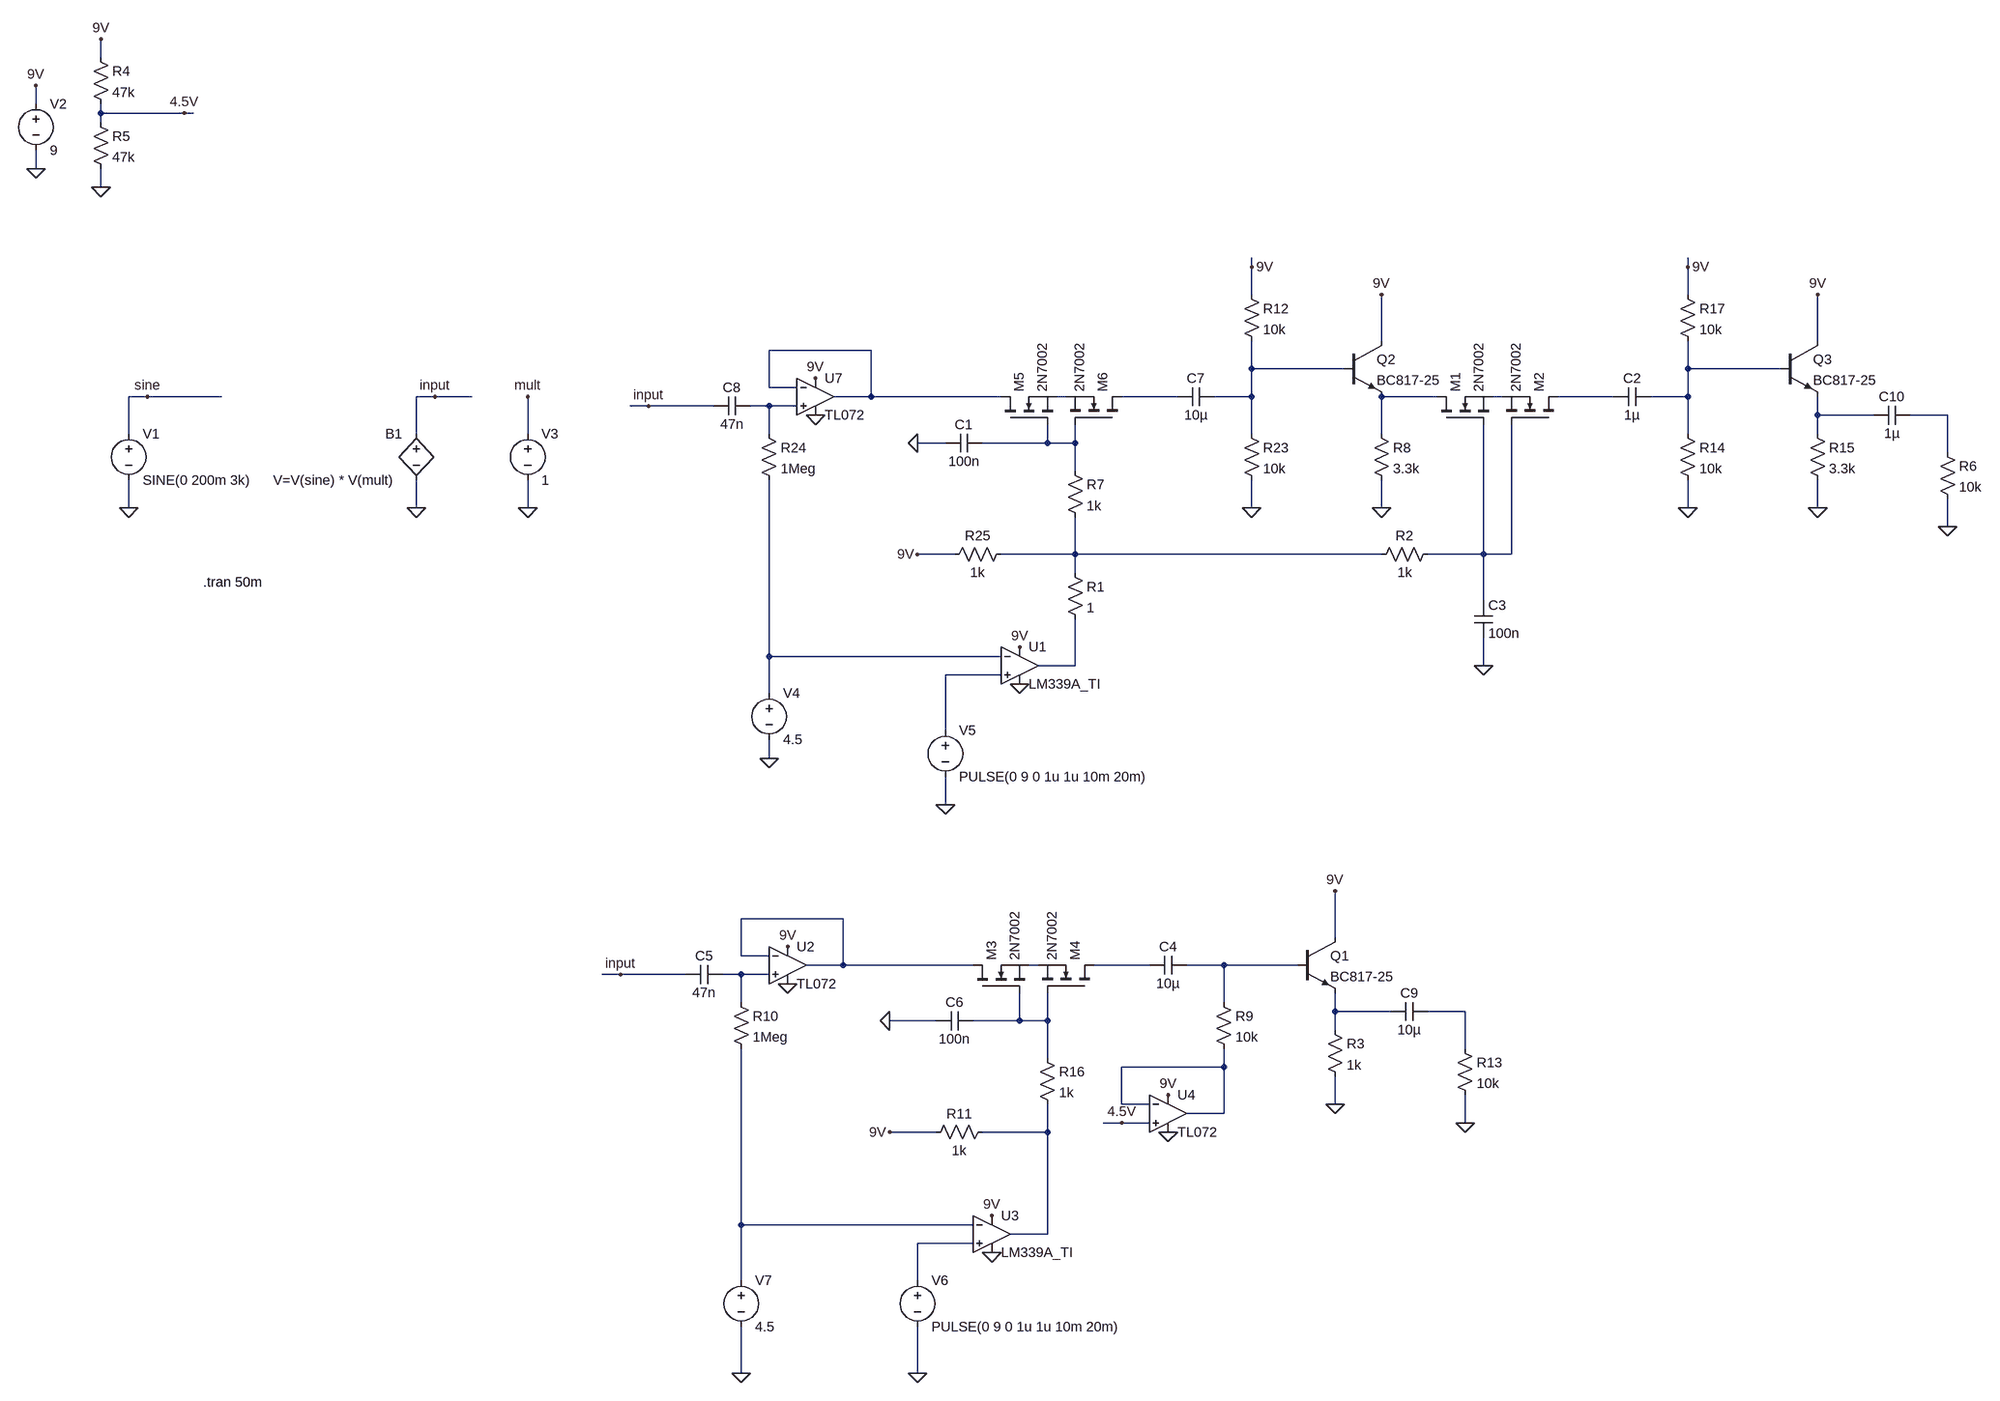
[diagram p0: schematic MOSFET_off_switch.asc]
MOSFET_off_switch.asc, the LTspice schematic file:
Version 4
SHEET 1 4932 2004
WIRE -656 -464 -656 -496
WIRE -768 -384 -768 -416
WIRE -656 -368 -656 -384
WIRE -512 -368 -656 -368
WIRE -496 -368 -512 -368
WIRE -656 -352 -656 -368
WIRE -768 -272 -768 -304
WIRE -656 -240 -656 -272
WIRE 1328 -16 1328 -32
WIRE 2080 -16 2080 -32
WIRE 1328 32 1328 -16
WIRE 2080 32 2080 -16
WIRE 1552 112 1552 32
WIRE 2304 112 2304 32
WIRE 672 128 496 128
WIRE 1328 160 1328 112
WIRE 1488 160 1328 160
WIRE 2080 160 2080 112
WIRE 2240 160 2080 160
WIRE 496 192 496 128
WIRE 544 192 496 192
WIRE -576 208 -608 208
WIRE -448 208 -576 208
WIRE -80 208 -112 208
WIRE -16 208 -80 208
WIRE 672 208 672 128
WIRE 672 208 608 208
WIRE 896 208 672 208
WIRE 1008 208 992 208
WIRE 1200 208 1104 208
WIRE 1328 208 1328 160
WIRE 1328 208 1264 208
WIRE 1648 208 1552 208
WIRE 1760 208 1744 208
WIRE 1952 208 1856 208
WIRE 2080 208 2080 160
WIRE 2080 208 2016 208
WIRE 288 224 256 224
WIRE 400 224 288 224
WIRE 496 224 464 224
WIRE 544 224 496 224
WIRE 2304 240 2304 208
WIRE 2400 240 2304 240
WIRE 2528 240 2464 240
WIRE -608 272 -608 208
WIRE -112 272 -112 208
WIRE 80 272 80 208
WIRE 496 272 496 224
WIRE 1328 272 1328 208
WIRE 1552 272 1552 208
WIRE 2080 272 2080 208
WIRE 2304 272 2304 240
WIRE 800 288 752 288
WIRE 976 288 976 256
WIRE 976 288 864 288
WIRE 1024 288 1024 256
WIRE 1024 288 976 288
WIRE 2528 304 2528 240
WIRE 1024 336 1024 288
WIRE -608 400 -608 352
WIRE -112 400 -112 352
WIRE 80 400 80 352
WIRE 1328 400 1328 352
WIRE 1552 400 1552 352
WIRE 2080 400 2080 352
WIRE 2304 400 2304 352
WIRE 2528 432 2528 384
WIRE 816 480 752 480
WIRE 1024 480 1024 416
WIRE 1024 480 896 480
WIRE 1552 480 1024 480
WIRE 1728 480 1728 256
WIRE 1728 480 1632 480
WIRE 1776 480 1776 256
WIRE 1776 480 1728 480
WIRE 1024 512 1024 480
WIRE 1728 560 1728 480
WIRE 496 656 496 352
WIRE 896 656 496 656
WIRE 1024 672 1024 592
WIRE 1024 672 960 672
WIRE 1728 672 1728 624
WIRE 896 688 800 688
WIRE 496 720 496 656
WIRE 800 784 800 688
WIRE 496 832 496 800
WIRE 800 912 800 864
WIRE 624 1184 448 1184
WIRE 1472 1216 1472 1136
WIRE 448 1248 448 1184
WIRE 496 1248 448 1248
WIRE 624 1264 624 1184
WIRE 624 1264 560 1264
WIRE 848 1264 624 1264
WIRE 960 1264 944 1264
WIRE 1152 1264 1056 1264
WIRE 1280 1264 1216 1264
WIRE 1408 1264 1280 1264
WIRE 240 1280 208 1280
WIRE 352 1280 240 1280
WIRE 448 1280 416 1280
WIRE 496 1280 448 1280
WIRE 448 1328 448 1280
WIRE 1280 1328 1280 1264
WIRE 1472 1344 1472 1312
WIRE 1568 1344 1472 1344
WIRE 1696 1344 1632 1344
WIRE 784 1360 704 1360
WIRE 928 1360 928 1312
WIRE 928 1360 848 1360
WIRE 976 1360 976 1312
WIRE 976 1360 928 1360
WIRE 1472 1376 1472 1344
WIRE 1696 1408 1696 1344
WIRE 976 1424 976 1360
WIRE 1280 1440 1280 1408
WIRE 1280 1440 1104 1440
WIRE 1104 1504 1104 1440
WIRE 1152 1504 1104 1504
WIRE 1472 1504 1472 1456
WIRE 1280 1520 1280 1440
WIRE 1280 1520 1216 1520
WIRE 1104 1536 1072 1536
WIRE 1152 1536 1104 1536
WIRE 1696 1536 1696 1488
WIRE 784 1552 704 1552
WIRE 976 1552 976 1504
WIRE 976 1552 864 1552
WIRE 448 1712 448 1408
WIRE 848 1712 448 1712
WIRE 976 1728 976 1552
WIRE 976 1728 912 1728
WIRE 848 1744 752 1744
WIRE 448 1808 448 1712
WIRE 752 1808 752 1744
WIRE 448 1968 448 1888
WIRE 752 1968 752 1888
FLAG -768 -416 9V
FLAG -768 -272 0
FLAG -656 -496 9V
FLAG -656 -240 0
FLAG -512 -368 4.5V
FLAG -608 400 0
FLAG 80 400 0
FLAG 80 208 mult
FLAG -112 400 0
FLAG -576 208 sine
FLAG -80 208 input
FLAG 288 224 input
FLAG 576 176 9V
FLAG 576 240 0
FLAG 752 480 9V
FLAG 800 912 0
FLAG 496 832 0
FLAG 752 288 0
FLAG 928 640 9V
FLAG 928 704 0
FLAG 1728 672 0
FLAG 240 1280 input
FLAG 528 1232 9V
FLAG 528 1296 0
FLAG 704 1552 9V
FLAG 752 1968 0
FLAG 448 1968 0
FLAG 704 1360 0
FLAG 880 1696 9V
FLAG 880 1760 0
FLAG 1184 1488 9V
FLAG 1184 1552 0
FLAG 1104 1536 4.5V
FLAG 1472 1504 0
FLAG 1472 1136 9V
FLAG 1552 400 0
FLAG 1552 32 9V
FLAG 1328 400 0
FLAG 1328 -16 9V
FLAG 1696 1536 0
FLAG 2304 400 0
FLAG 2304 32 9V
FLAG 2080 400 0
FLAG 2080 -16 9V
FLAG 2528 432 0
SYMBOL voltage -608 256 R0
WINDOW 123 0 0 Left 0
WINDOW 39 0 0 Left 0
SYMATTR InstName V1
SYMATTR Value SINE(0 200m 3k)
SYMBOL voltage -768 -400 R0
WINDOW 123 0 0 Left 0
WINDOW 39 0 0 Left 0
SYMATTR InstName V2
SYMATTR Value 9
SYMBOL res -672 -480 R0
SYMATTR InstName R4
SYMATTR Value 47k
SYMBOL res -672 -368 R0
SYMATTR InstName R5
SYMATTR Value 47k
SYMBOL voltage 80 256 R0
WINDOW 123 0 0 Left 0
WINDOW 39 0 0 Left 0
SYMATTR InstName V3
SYMATTR Value 1
SYMBOL bv -112 256 M0
WINDOW 3 40 96 Left 2
SYMATTR Value V=V(sine) * V(mult)
SYMATTR InstName B1
SYMBOL ZZZ\\OpAmp\\TL072 576 208 R0
SYMATTR InstName U7
SYMBOL cap 1264 192 R90
WINDOW 0 0 32 VBottom 2
WINDOW 3 32 32 VTop 2
SYMATTR InstName C7
SYMATTR Value 10µ
SYMBOL res 1312 256 R0
SYMATTR InstName R23
SYMATTR Value 10k
SYMBOL res 480 256 R0
SYMATTR InstName R24
SYMATTR Value 1Meg
SYMBOL cap 464 208 R90
WINDOW 0 0 32 VBottom 2
WINDOW 3 32 32 VTop 2
SYMATTR InstName C8
SYMATTR Value 47n
SYMBOL nmos 896 256 R270
SYMATTR InstName M5
SYMATTR Value 2N7002
SYMBOL nmos 1104 256 M270
SYMATTR InstName M6
SYMATTR Value 2N7002
SYMBOL res 912 464 R90
WINDOW 0 0 56 VBottom 2
WINDOW 3 32 56 VTop 2
SYMATTR InstName R25
SYMATTR Value 1k
SYMBOL voltage 800 768 R0
WINDOW 123 0 0 Left 0
WINDOW 39 0 0 Left 0
SYMATTR InstName V5
SYMATTR Value PULSE(0 9 0 1u 1u 10m 20m)
SYMBOL voltage 496 704 R0
WINDOW 123 0 0 Left 0
WINDOW 39 0 0 Left 0
SYMATTR InstName V4
SYMATTR Value 4.5
SYMBOL cap 864 272 R90
WINDOW 0 0 32 VBottom 2
WINDOW 3 32 32 VTop 2
SYMATTR InstName C1
SYMATTR Value 100n
SYMBOL res 1008 496 R0
SYMATTR InstName R1
SYMATTR Value 1
SYMBOL cap 2016 192 R90
WINDOW 0 0 32 VBottom 2
WINDOW 3 32 32 VTop 2
SYMATTR InstName C2
SYMATTR Value 1µ
SYMBOL nmos 1648 256 R270
SYMATTR InstName M1
SYMATTR Value 2N7002
SYMBOL nmos 1856 256 M270
SYMATTR InstName M2
SYMATTR Value 2N7002
SYMBOL ZZZ\\Comparator\\LM339A_TI 928 672 R0
SYMATTR InstName U1
SYMBOL res 1648 464 R90
WINDOW 0 0 56 VBottom 2
WINDOW 3 32 56 VTop 2
SYMATTR InstName R2
SYMATTR Value 1k
SYMBOL cap 1712 560 R0
SYMATTR InstName C3
SYMATTR Value 100n
SYMBOL res 1008 320 R0
SYMATTR InstName R7
SYMATTR Value 1k
SYMBOL ZZZ\\OpAmp\\TL072 528 1264 R0
SYMATTR InstName U2
SYMBOL cap 1216 1248 R90
WINDOW 0 0 32 VBottom 2
WINDOW 3 32 32 VTop 2
SYMATTR InstName C4
SYMATTR Value 10µ
SYMBOL res 1264 1312 R0
SYMATTR InstName R9
SYMATTR Value 10k
SYMBOL res 432 1312 R0
SYMATTR InstName R10
SYMATTR Value 1Meg
SYMBOL cap 416 1264 R90
WINDOW 0 0 32 VBottom 2
WINDOW 3 32 32 VTop 2
SYMATTR InstName C5
SYMATTR Value 47n
SYMBOL nmos 848 1312 R270
SYMATTR InstName M3
SYMATTR Value 2N7002
SYMBOL nmos 1056 1312 M270
SYMATTR InstName M4
SYMATTR Value 2N7002
SYMBOL res 880 1536 R90
WINDOW 0 0 56 VBottom 2
WINDOW 3 32 56 VTop 2
SYMATTR InstName R11
SYMATTR Value 1k
SYMBOL voltage 752 1792 R0
WINDOW 123 0 0 Left 0
WINDOW 39 0 0 Left 0
SYMATTR InstName V6
SYMATTR Value PULSE(0 9 0 1u 1u 10m 20m)
SYMBOL voltage 448 1792 R0
WINDOW 123 0 0 Left 0
WINDOW 39 0 0 Left 0
SYMATTR InstName V7
SYMATTR Value 4.5
SYMBOL cap 848 1344 R90
WINDOW 0 0 32 VBottom 2
WINDOW 3 32 32 VTop 2
SYMATTR InstName C6
SYMATTR Value 100n
SYMBOL ZZZ\\Comparator\\LM339A_TI 880 1728 R0
SYMATTR InstName U3
SYMBOL res 960 1408 R0
SYMATTR InstName R16
SYMATTR Value 1k
SYMBOL ZZZ\\OpAmp\\TL072 1184 1520 R0
SYMATTR InstName U4
SYMBOL npn 1408 1216 R0
SYMATTR InstName Q1
SYMATTR Value BC817-25
SYMBOL res 1456 1360 R0
SYMATTR InstName R3
SYMATTR Value 1k
SYMBOL npn 1488 112 R0
SYMATTR InstName Q2
SYMATTR Value BC817-25
SYMBOL res 1536 256 R0
SYMATTR InstName R8
SYMATTR Value 3.3k
SYMBOL res 1312 16 R0
SYMATTR InstName R12
SYMATTR Value 10k
SYMBOL cap 1632 1328 R90
WINDOW 0 0 32 VBottom 2
WINDOW 3 32 32 VTop 2
SYMATTR InstName C9
SYMATTR Value 10µ
SYMBOL res 1680 1392 R0
SYMATTR InstName R13
SYMATTR Value 10k
SYMBOL res 2064 256 R0
SYMATTR InstName R14
SYMATTR Value 10k
SYMBOL npn 2240 112 R0
SYMATTR InstName Q3
SYMATTR Value BC817-25
SYMBOL res 2288 256 R0
SYMATTR InstName R15
SYMATTR Value 3.3k
SYMBOL res 2064 16 R0
SYMATTR InstName R17
SYMATTR Value 10k
SYMBOL cap 2464 224 R90
WINDOW 0 0 32 VBottom 2
WINDOW 3 32 32 VTop 2
SYMATTR InstName C10
SYMATTR Value 1µ
SYMBOL res 2512 288 R0
SYMATTR InstName R6
SYMATTR Value 10k
TEXT -480 528 Left 2 !.tran 50m

The netlist it stands for:
* MOSFET_off_switch.asc
V1 sine 0 SINE(0 200m 3k)
V2 9V 0 9
R4 9V 4.5V 47k
R5 4.5V 0 47k
V3 mult 0 1
B1 input 0 V=V(sine) * V(mult)
* U7: TL072 (symbol ZZZ\OpAmp\TL072 not available, pins judged from their places): In+=N009 In-=N001 V+=9V V-=0 OUT=N001
C7 N002 N005 10µ
R23 N002 0 10k
R24 N009 N015 1Meg
C8 N009 input 47n
M5 N001 N012 N004 N004 2N7002
M6 N005 N012 N004 N004 2N7002
R25 N013 9V 1k
V5 N017 0 PULSE(0 9 0 1u 1u 10m 20m)
V4 N015 0 4.5
C1 N012 0 100n
R1 N013 N016 1
C2 N003 N008 1µ
M1 N006 N014 N007 N007 2N7002
M2 N008 N014 N007 N007 2N7002
* U1: LM339A_TI (symbol ZZZ\Comparator\LM339A_TI not available, pins judged from their places): In+=N017 In-=N015 V+=9V V-=0 OUT=N016
R2 N014 N013 1k
C3 N014 0 100n
R7 N012 N013 1k
* U2: TL072 (symbol ZZZ\OpAmp\TL072 not available, pins judged from their places): In+=N022 In-=N018 V+=9V V-=0 OUT=N018
C4 N021 N020 10µ
R9 N021 N026 10k
R10 N022 N028 1Meg
C5 N022 input 47n
M3 N018 N025 N019 N019 2N7002
M4 N020 N025 N019 N019 2N7002
R11 N027 9V 1k
V6 N029 0 PULSE(0 9 0 1u 1u 10m 20m)
V7 N028 0 4.5
C6 N025 0 100n
* U3: LM339A_TI (symbol ZZZ\Comparator\LM339A_TI not available, pins judged from their places): In+=N029 In-=N028 V+=9V V-=0 OUT=N027
R16 N025 N027 1k
* U4: TL072 (symbol ZZZ\OpAmp\TL072 not available, pins judged from their places): In+=4.5V In-=N026 V+=9V V-=0 OUT=N026
Q1 9V N021 N023 0 BC817-25
R3 N023 0 1k
Q2 9V N002 N006 0 BC817-25
R8 N006 0 3.3k
R12 9V N002 10k
C9 N024 N023 10µ
R13 N024 0 10k
R14 N003 0 10k
Q3 9V N003 N010 0 BC817-25
R15 N010 0 3.3k
R17 9V N003 10k
C10 N011 N010 1µ
R6 N011 0 10k
.model NPN NPN
.model PNP PNP
.lib standard.bjt
.model NMOS NMOS
.model PMOS PMOS
.lib standard.mos
.tran 50m
.backanno
.end